# EAGLE design Roboteq_Board_V1.0 (EAGLE 9.2.2)
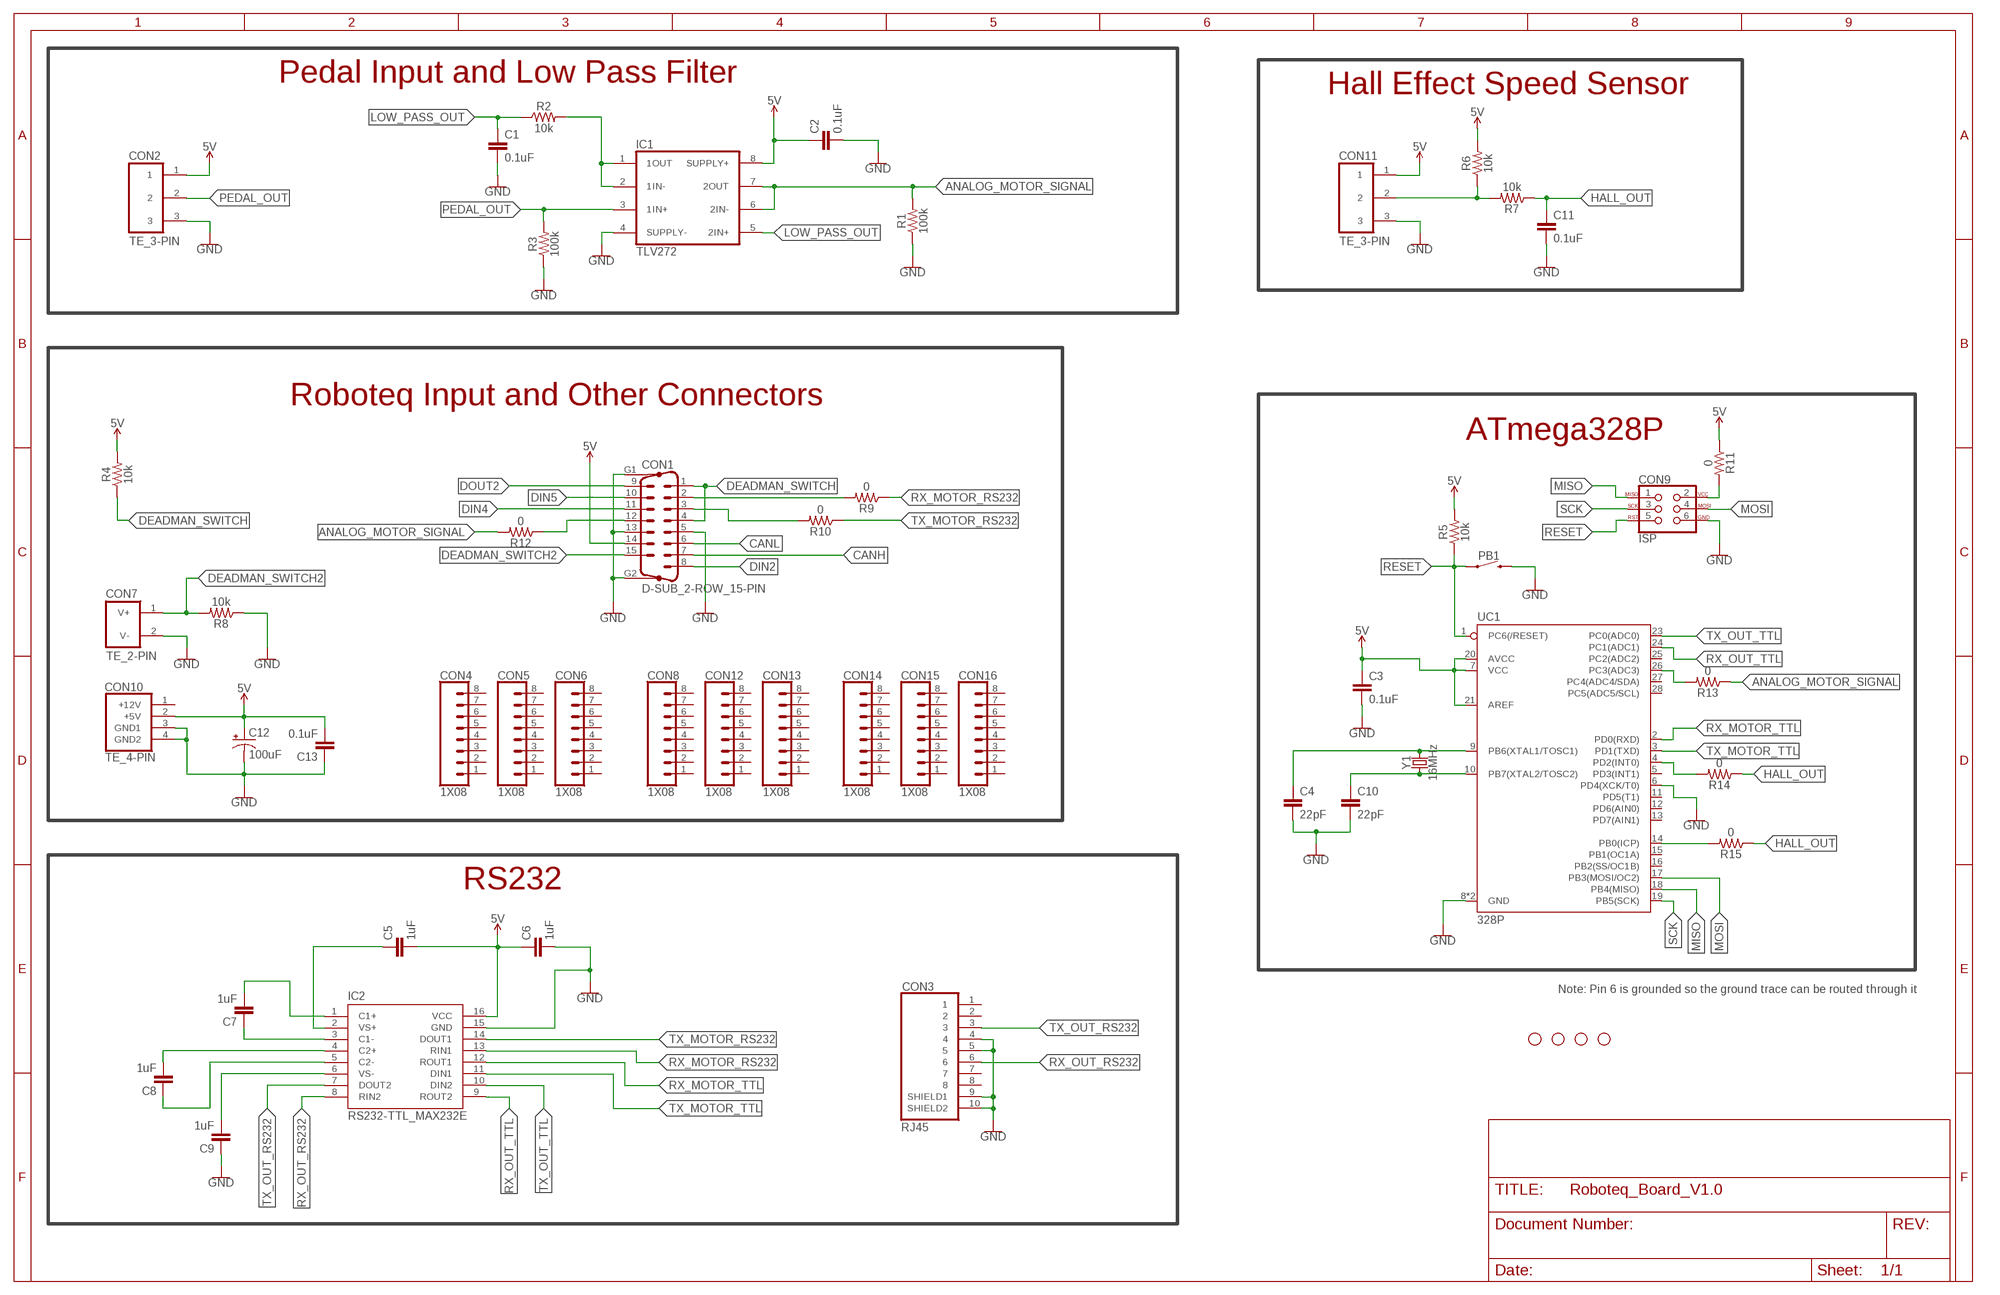
[diagram p0: schematic, sheet 1]

## Parts
C1  0.1uF  CAPACITOR_CERAMIC_THROUGH-HOLE  [CAP-PTH-5MM]
C2  0.1uF  CAPACITOR_CERAMIC_THROUGH-HOLE  [CAP-PTH-5MM]
C3  0.1uF  CAPACITOR_CERAMIC_THROUGH-HOLE  [CAP-PTH-5MM]
C4  22pF  CAPACITOR_CERAMIC_THROUGH-HOLE  [CAP-PTH-5MM]
C5  1uF  CAPACITOR_CERAMIC_THROUGH-HOLE  [CAP-PTH-5MM]
C6  1uF  CAPACITOR_CERAMIC_THROUGH-HOLE  [CAP-PTH-5MM]
C7  1uF  CAPACITOR_CERAMIC_THROUGH-HOLE  [CAP-PTH-5MM]
C8  1uF  CAPACITOR_CERAMIC_THROUGH-HOLE  [CAP-PTH-5MM]
C9  1uF  CAPACITOR_CERAMIC_THROUGH-HOLE  [CAP-PTH-5MM]
C10  22pF  CAPACITOR_CERAMIC_THROUGH-HOLE  [CAP-PTH-5MM]
C11  0.1uF  CAPACITOR_CERAMIC_THROUGH-HOLE  [CAP-PTH-5MM]
C12  100uF  CAPACITOR_ELECTROLYTIC_100UF  [CAPACITOR_100UF_50V]
C13  0.1uF  CAPACITOR_CERAMIC_THROUGH-HOLE  [CAP-PTH-5MM]
CON1  D-SUB_2-ROW_15-PIN  [D-SUB_2-ROW_15-PIN]
CON2  TE_3-PIN  [TE_3-PIN]
CON3  RJ45  [RJ45]
CON4  1X08  [1X08]
CON5  1X08  [1X08]
CON6  1X08  [1X08]
CON7  TE_2-PIN  [TE_2-PIN]
CON8  1X08  [1X08]
CON9  ISP  [ISP_CONNECTOR]
CON10  TE_4-PIN  [TE_4-PIN]
CON11  TE_3-PIN  [TE_3-PIN]
CON12  1X08  [1X08]
CON13  1X08  [1X08]
CON14  1X08  [1X08]
CON15  1X08  [1X08]
CON16  1X08  [1X08]
H1  STAND-OFF  [STAND-OFF]
H2  STAND-OFF  [STAND-OFF]
H3  STAND-OFF  [STAND-OFF]
H4  STAND-OFF  [STAND-OFF]
IC1  TLV272  OP-AMP_DUAL  [DIP08]
IC2  RS232-TTL_MAX232E  [DIP16]
PB1  PUSHBUTTON  [PUSHBUTTON]
R1  100k  RESISTOR_THROUGH-HOLE_1/4W  [AXIAL-0.3]
R2  10k  RESISTOR_THROUGH-HOLE_1/4W  [AXIAL-0.3]
R3  100k  RESISTOR_THROUGH-HOLE_1/4W  [AXIAL-0.3]
R4  10k  RESISTOR_THROUGH-HOLE_1/4W  [AXIAL-0.3]
R5  10k  RESISTOR_THROUGH-HOLE_1/4W  [AXIAL-0.3]
R6  10k  RESISTOR_THROUGH-HOLE_1/4W  [AXIAL-0.3]
R7  10k  RESISTOR_THROUGH-HOLE_1/4W  [AXIAL-0.3]
R8  10k  RESISTOR_THROUGH-HOLE_1/4W  [AXIAL-0.3]
R9  0  RESISTOR_THROUGH-HOLE_1/4W  [AXIAL-0.3]
R10  0  RESISTOR_THROUGH-HOLE_1/4W  [AXIAL-0.3]
R11  0  RESISTOR_THROUGH-HOLE_1/4W  [AXIAL-0.3]
R12  0  RESISTOR_THROUGH-HOLE_1/4W  [AXIAL-0.3]
R13  0  RESISTOR_THROUGH-HOLE_1/4W  [AXIAL-0.3]
R14  0  RESISTOR_THROUGH-HOLE_1/4W  [AXIAL-0.3]
R15  0  RESISTOR_THROUGH-HOLE_1/4W  [AXIAL-0.3]
UC1  328P  ATMEGA328P_DIP28  [DIP28]
Y1  16MHz  CRYSTAL-16MHZPTH-HC49US  [HC49US]

## Nets
5V: C2.1 C3.1 C5.2 C6.1 C12.+ C13.2 CON1.14 CON2.1 CON10.2(+5V) CON11.1 IC1.8(SUPPLY+) IC2.16(VCC) R4.P$2 R5.P$2 R6.P$2 R11.P$1 UC1.7(VCC) UC1.20(AVCC) UC1.21(AREF)
ANALOG_MOTOR_SIGNAL: IC1.6(2IN-) IC1.7(2OUT) R1.P$2 R12.P$2 R13.P$1
CANH: CON1.7
CANL: CON1.6
DEADMAN_SWITCH: CON1.1 CON1.4 R4.P$1
DEADMAN_SWITCH2: CON1.15 CON7.1(V+) R8.P$2
DIN2: CON1.8
DIN4: CON1.11
DIN5: CON1.10
DOUT2: CON1.9
GND: C1.2 C2.2 C3.2 C4.2 C6.2 C9.1 C10.2 C11.2 C12.- C13.1 CON1.5 CON1.13 CON1.G1(GND1) CON1.G2(GND2) CON2.3 CON3.4 CON3.5 CON3.9(SHIELD1) CON3.10(SHIELD2) CON7.2(V-) CON9.6 CON10.3(GND1) CON10.4(GND2) CON11.3 IC1.4(SUPPLY-) IC2.15(GND) PB1.3 PB1.4 R1.P$1 R3.P$1 R8.P$1 UC1.6(PD4(XCK/T0)) UC1.8(GND) UC1.22(GND)
HALL_OUT: C11.1 R7.P$1 R14.P$1 R15.P$1
LOW_PASS_OUT: C1.1 IC1.5(2IN+) R2.P$1
MISO: CON9.1 UC1.18(PB4(MISO))
MOSI: CON9.4 UC1.17(PB3(MOSI/OC2))
N$1: CON1.2 R9.P$2
N$2: IC1.1(1OUT) IC1.2(1IN-) R2.P$2
N$3: R13.P$2 UC1.26(PC3(ADC3))
N$4: C4.1 UC1.9(PB6(XTAL1/TOSC1)) Y1.2
N$5: C10.1 UC1.10(PB7(XTAL2/TOSC2)) Y1.1
N$6: C7.2 IC2.1(C1+)
N$7: C5.1 IC2.2(VS+)
N$8: C7.1 IC2.3(C1-)
N$9: C8.2 IC2.4(C2+)
N$10: C8.1 IC2.5(C2-)
N$11: C9.2 IC2.6(VS-)
N$12: CON11.2 R6.P$1 R7.P$2
N$13: CON1.3 R10.P$2
N$14: CON9.2 R11.P$2
N$15: CON1.12 R12.P$1
N$16: R14.P$2 UC1.4(PD2(INT0))
N$17: R15.P$2 UC1.14(PB0(ICP))
PEDAL_OUT: CON2.2 IC1.3(1IN+) R3.P$2
RESET: CON9.5 PB1.1 PB1.2 R5.P$1 UC1.1(PC6(/RESET))
RX_MOTOR_RS232: IC2.13(RIN1) R9.P$1
RX_MOTOR_TTL: IC2.12(ROUT1) UC1.2(PD0(RXD))
RX_OUT_RS232: CON3.6 IC2.8(RIN2)
RX_OUT_TTL: IC2.9(ROUT2) UC1.24(PC1(ADC1))
SCK: CON9.3 UC1.19(PB5(SCK))
TX_MOTOR_RS232: IC2.14(DOUT1) R10.P$1
TX_MOTOR_TTL: IC2.11(DIN1) UC1.3(PD1(TXD))
TX_OUT_RS232: CON3.3 IC2.7(DOUT2)
TX_OUT_TTL: IC2.10(DIN2) UC1.23(PC0(ADC0))
Unconnected: CON3.1 CON3.2 CON3.7 CON3.8 CON4.1 CON4.2 CON4.3 CON4.4 CON4.5 CON4.6 CON4.7 CON4.8 CON5.1 CON5.2 CON5.3 CON5.4 CON5.5 CON5.6 CON5.7 CON5.8 CON6.1 CON6.2 CON6.3 CON6.4 CON6.5 CON6.6 CON6.7 CON6.8 CON8.1 CON8.2 CON8.3 CON8.4 CON8.5 CON8.6 CON8.7 CON8.8 CON10.1(+12V) CON12.1 CON12.2 CON12.3 CON12.4 CON12.5 CON12.6 CON12.7 CON12.8 CON13.1 CON13.2 CON13.3 CON13.4 CON13.5 CON13.6 CON13.7 CON13.8 CON14.1 CON14.2 CON14.3 CON14.4 CON14.5 CON14.6 CON14.7 CON14.8 CON15.1 CON15.2 CON15.3 CON15.4 CON15.5 CON15.6 CON15.7 CON15.8 CON16.1 CON16.2 CON16.3 CON16.4 CON16.5 CON16.6 CON16.7 CON16.8 UC1.5(PD3(INT1)) UC1.11(PD5(T1)) UC1.12(PD6(AIN0)) UC1.13(PD7(AIN1)) UC1.15(PB1(OC1A)) UC1.16(PB2(SS/OC1B)) UC1.25(PC2(ADC2)) UC1.27(PC4(ADC4/SDA)) UC1.28(PC5(ADC5/SCL))

## Notes on the sheet
- Pedal Input and Low Pass Filter
- Hall Effect Speed Sensor
- Roboteq Input and Other Connectors
- ATmega328P
- RS232
- Note: Pin 6 is grounded so the ground trace can be routed through it

## Library data of the parts
C1-C11 C13 = EcoCar-Passives:CAPACITOR_CERAMIC_THROUGH-HOLE
C12 = EcoCar-Passives:CAPACITOR_ELECTROLYTIC_100UF: 50V 100uF Electrolytic Capacitor Manufacturer: Nichicon Series: UVZ Part Number: UVZ1H101MPD1TD Digikey Part Number: 493-13464-1-ND
CON1 = EcoCar-Connectors:D-SUB_2-ROW_15-PIN: 15 Pin D-SUB for Roboteq Motor Controller Female Connector Part: AE10931-ND
CON2 CON11 = EcoCar-Connectors:TE_3-PIN: 3 Pin TE Mini-Universal MATE-N-LOK Part Number: 1-770967-0 Digikey Part Number: A32473-ND Matching Plug: A25588-ND Matching Crimps: A100828CT-ND
CON3 = EcoCar-Connectors:RJ45: RJ45 Connector - Use for signals and low power connections Unshielded Part Number: RJHSE-5080 Unshielded Digikey Part Number: RJHSE-5080-ND Shielded Part Number: RJHSE5E80 Shielded Digikey Part Number: RJHSE5E80-ND
CON4-CON6 CON8 CON12-CON16 = EcoCar-Connectors-2.54mm:1X08: 2.54mm (0.1") Header
CON7 = EcoCar-Connectors:TE_2-PIN: 2 Pin TE Mini-Universal MATE-N-LOK - Use for signals and power connections Part Number: 1-770966-0 Digikey Part Number: A32471-ND Matching Plug: A25587-ND Matching Crimps: A100828CT-ND
CON9 = EcoCar-Microcontrollers:ISP: ISP Header Use for programming microcontrollers such as the 328P
CON10 = EcoCar-Connectors:TE_4-PIN: 4 Pin TE Mini-Universal MATE-N-LOK - Use for 12V and 5V connections Part Number: 1-770968-0 Digikey Part Number: A32474-ND Matching Plug: A25571-ND Matching Crimps: A100828CT-ND
H1-H4 = EcoCar-Miscellaneous:STAND-OFF: Stand Off Drill holes for mechanically mounting via screws, standoffs, etc. Note: Use the keepout ring to avoid running the screw head into surrounding components. Variant Overviews STAND-OFF - Mechanical footprint for a #4 phillips button head screw. STAND-OFF-TIGHT - Mechanical footprint for a #4 phillips button head screw, Example SparkFun Products Screw - Phillips Head (1/4", 4-40, 10 pack) <https://www.sparkfun.com/products/10453> (PRT-10453) Screw - Phillips Head (1/2", 4-40, 10 pack) <https://www.sparkfun.com/products/10452> (PRT-10452) Screw - Phillips Head (3/4", 4-40, 10 pack) <https://www.sparkfun.com/products/10451> (PRT-10451) Screw - Phillips Head (1", 4-40, 10 pack) <https://www.sparkfun.com/products/10450> (PRT-10450)
IC1 = EcoCar-Integrated-Circuits:OP-AMP_DUAL
IC2 = EcoCar-Integrated-Circuits:RS232-TTL_MAX232E: Dual 5V TTL to RS-232 Converter Manufacturer: Texas Instruments Part Number: MAX232EIN Digikey Part Number: 296-27963-5-ND
PB1 = EcoCar-Electromechanical:PUSHBUTTON: Pushbutton Manufacturer: TE Connectivity ALCOSWITCH Switches Part Number: 1825910-6 Digikey Part Number: 450-1650-ND
R1-R15 = EcoCar-Passives:RESISTOR_THROUGH-HOLE_1/4W
UC1 = EcoCar-Microcontrollers:ATMEGA328P_DIP28: ATmega328P Manufacturer: Microchip Part Number: ATMEGA328P-PU Digikey Part Number: ATMEGA328P-PU-ND; PROD_ID: IC-09136
Y1 = EcoCar-Microcontrollers:CRYSTAL-16MHZ: 16MHz Crystal Oscillator Manufacturer: TXC Part Number: 9B-16.000MBBK-B Digikey Part Number: 887-2015-ND; PROD_ID: XTAL-08181; SF_ID: COM-00536

## Board
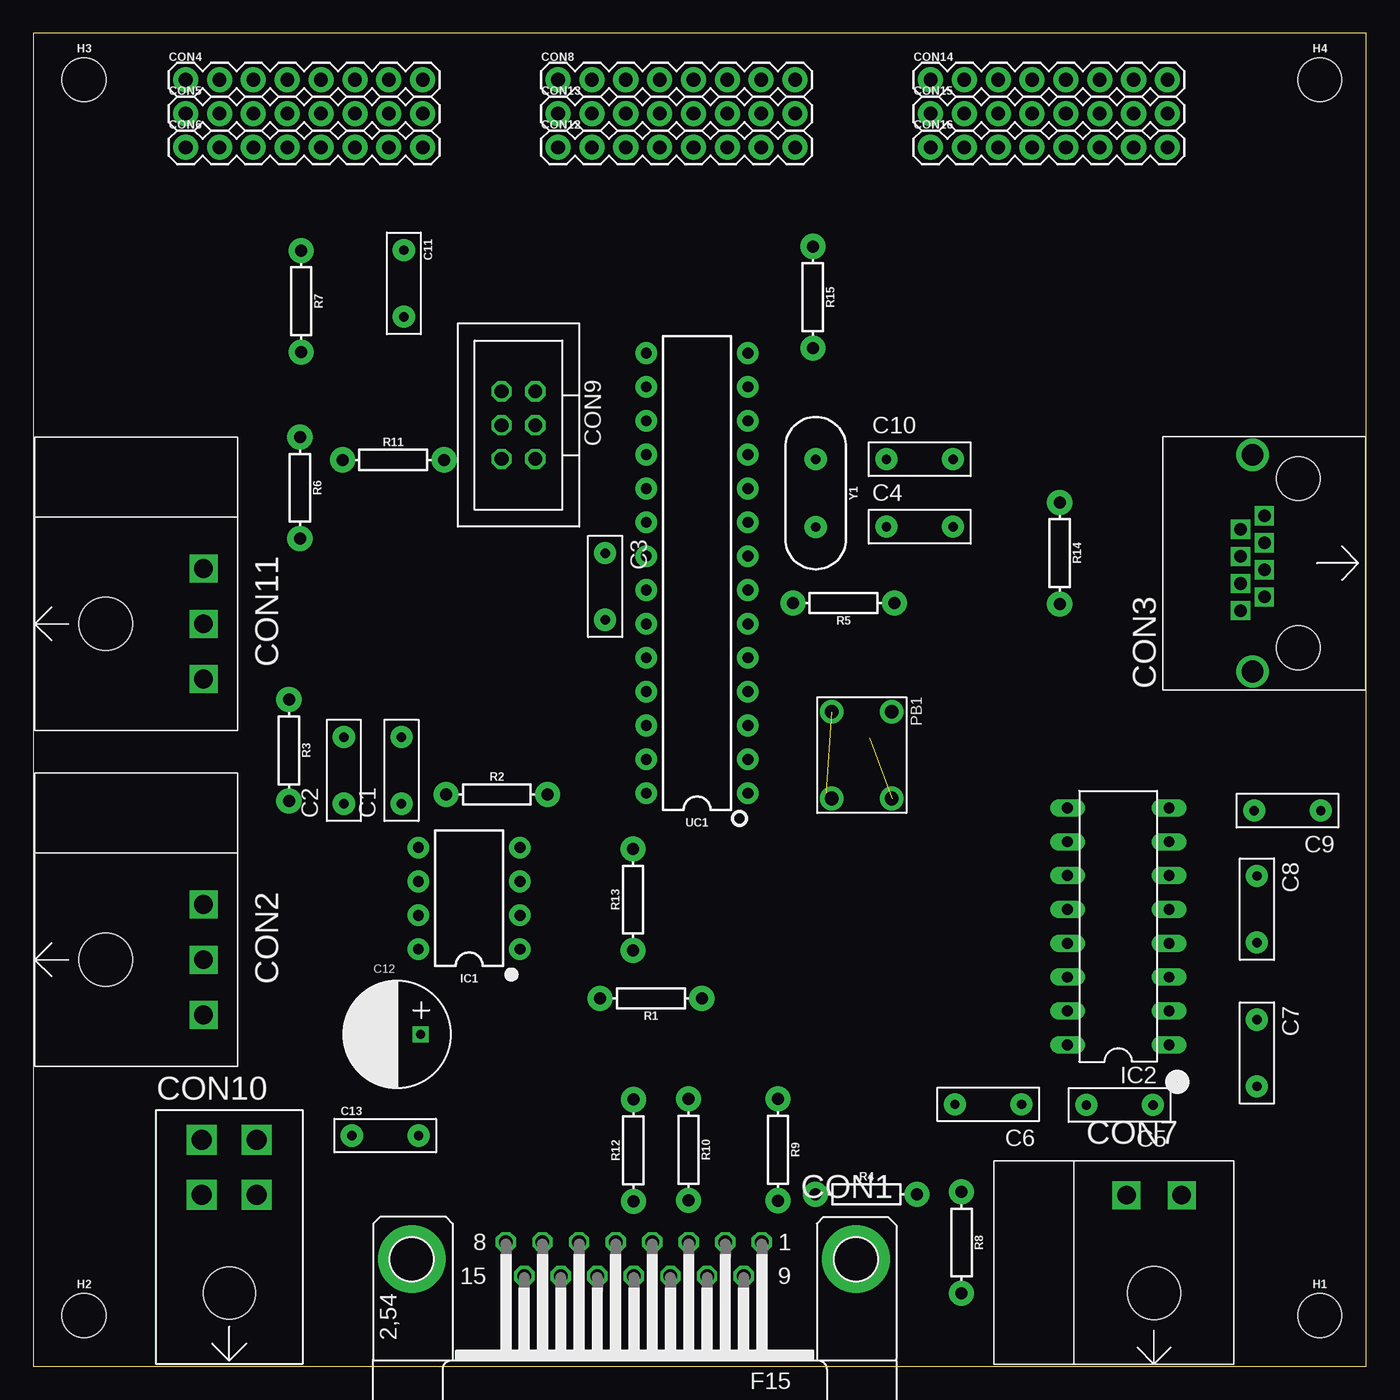
[diagram p1: board, top side]
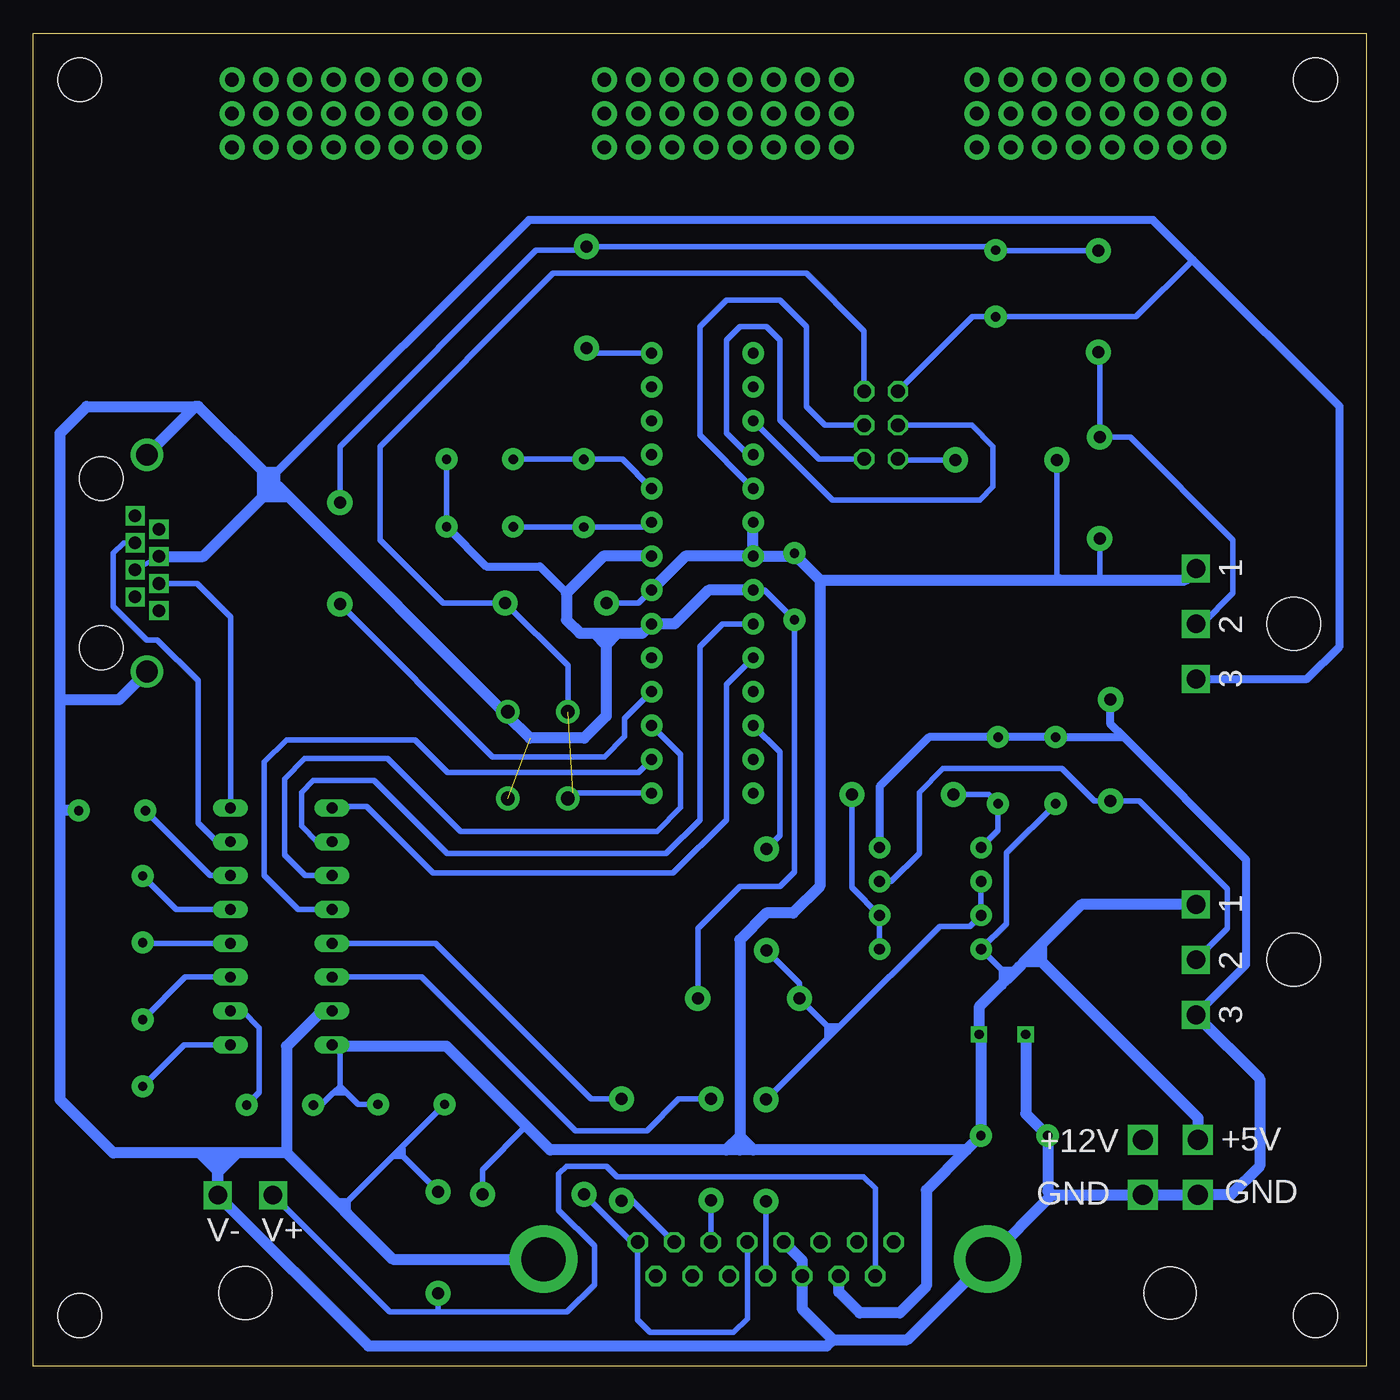
[diagram p2: board, bottom side, seen from below]

Size 100 x 100 mm. Coordinates in mm from the lower left corner, seen from the top.
Outline: 0,0 100,0 100,100 0,100 0,0
Copper layers (1*16): Top 0.035mm / dielectric 1.5mm / Bottom 0.035mm
Design rules "SeeedStudio_2layer_DRU_no_angle_20140221": minimum track width 6mil, minimum drill 12mil, track to track 6mil, track to pad 6mil, pad to pad 6mil, via to via 6mil, smd to smd 0mil, copper to edge 10mil, drill to drill 10mil, minimum pad ring 10mil, minimum via ring 6mil, stop-mask expansion 2mil, vias tented up to drill 100mil, thermal gap 10mil

### Footprints (pad centres in the part's own frame; a part is rotated, then mirrored left to right if it is on the bottom)
CAP-PTH-5MM = drill 0.7 pad 1.651: 1 -2.5,0; 2 2.5,0
CAPACITOR_100UF_50V = drill 0.7 square: + 1.75,0; - -1.75,0
D-SUB_2-ROW_15-PIN = drill 1.016 octagon: 1 -9.601,-1.27; 2 -6.858,-1.27; 3 -4.115,-1.27; 4 -1.372,-1.27; 5 1.372,-1.27; 6 4.115,-1.27; 7 6.858,-1.27; 8 9.601,-1.27; 9 -8.23,1.27; 10 -5.486,1.27; 11 -2.743,1.27; 12 0,1.27; 13 2.743,1.27; 14 5.486,1.27; 15 8.23,1.27 | drill 3.302 pad 5.08: G1 -16.662,0; G2 16.662,0
TE_3-PIN = drill 1.4 square: 1 -4.14,12.67; 2 0,12.67; 3 4.14,12.67 | hole 4: 0,5.33
RJ45 = drill 0.94 square: 1 9.9,2.54; 2 8.88,4.32; 3 7.87,2.54; 4 6.85,4.32; 5 5.84,2.54; 6 4.82,4.32; 7 3.81,2.54; 8 2.79,4.32 | drill 1.62: 9 -1.78,3.43; 10 14.48,3.43 | hole 3.3: 0,0; 12.7,0
1X08 = drill 1.016 pad 1.88: 1 0,0; 2 2.54,0; 3 5.08,0; 4 7.62,0; 5 10.16,0; 6 12.7,0; 7 15.24,0; 8 17.78,0
TE_2-PIN = drill 1.4 square: 1 -2.07,12.67; 2 2.07,12.67 | hole 4: 0,5.33
ISP_CONNECTOR = drill 1.016 octagon: 1 2.54,1.27; 2 2.54,-1.27; 3 0,1.27; 4 0,-1.27; 5 -2.54,1.27; 6 -2.54,-1.27
TE_4-PIN = drill 1.5 square: 1 2.07,11.48; 2 -2.07,11.48; 3 2.07,7.34; 4 -2.07,7.34 | hole 3.91: 0,0
STAND-OFF = hole 3.302: 0,0
DIP08 = drill 0.813 pad 1.626: 1 -3.81,-3.81; 2 -1.27,-3.81; 3 1.27,-3.81; 4 3.81,-3.81; 5 3.81,3.81; 6 1.27,3.81; 7 -1.27,3.81; 8 -3.81,3.81
DIP16 = drill 0.813 long: 1 -8.89,-3.81; 2 -6.35,-3.81; 3 -3.81,-3.81; 4 -1.27,-3.81; 5 1.27,-3.81; 6 3.81,-3.81; 7 6.35,-3.81; 8 8.89,-3.81; 9 8.89,3.81; 10 6.35,3.81; 11 3.81,3.81; 12 1.27,3.81; 13 -1.27,3.81; 14 -3.81,3.81; 15 -6.35,3.81; 16 -8.89,3.81
PUSHBUTTON = drill 1.04 pad 1.778: 1 0,0; 2 6.5,0; 3 0,4.5; 4 6.5,4.5
AXIAL-0.3 = drill 0.9 pad 1.88: P$1 -3.81,0; P$2 3.81,0
DIP28 = drill 0.813 pad 1.626: 1 -16.51,-3.81; 2 -13.97,-3.81; 3 -11.43,-3.81; 4 -8.89,-3.81; 5 -6.35,-3.81; 6 -3.81,-3.81; 7 -1.27,-3.81; 8 1.27,-3.81; 9 3.81,-3.81; 10 6.35,-3.81; 11 8.89,-3.81; 12 11.43,-3.81; 13 13.97,-3.81; 14 16.51,-3.81; 15 16.51,3.81; 16 13.97,3.81; 17 11.43,3.81; 18 8.89,3.81; 19 6.35,3.81; 20 3.81,3.81; 21 1.27,3.81; 22 -1.27,3.81; 23 -3.81,3.81; 24 -6.35,3.81; 25 -8.89,3.81; 26 -11.43,3.81; 27 -13.97,3.81; 28 -16.51,3.81
HC49US = drill 0.7 pad 1.651: 1 -2.54,0; 2 2.54,0

### Placement (x,y rotation side)
C1  27.62,44.7 90 top
C2  23.3,44.7 90 top
C3  42.9,58.5 270 top
C4  66.5,62.98 0 top
C5  81.5,19.6 180 top
C6  71.64,19.65 180 top
C7  91.8,23.5 270 top
C8  91.8,34.29 270 top
C9  94.09,41.68 180 top
C10  66.5,68.05 0 top
C11  27.8,81.23 270 top
C12  27.3,24.9 0 top
C13  26.4,17.3 0 top
CON1  45.06,8.03 180 top
CON2  0.1,30.5 270 top
CON3  94.9,53.9 90 top
CON4  11.43,96.52 0 top
CON5  11.43,93.98 0 top
CON6  11.43,91.44 0 top
CON7  84.08,0.16 0 top
CON8  39.37,96.52 0 top
CON9  36.4,70.6 270 top
CON10  14.7,5.5 0 top
CON11  0.1,55.7 270 top
CON12  39.37,91.44 0 top
CON13  39.37,93.98 0 top
CON14  67.31,96.52 0 top
CON15  67.31,93.98 0 top
CON16  67.31,91.44 0 top
H1  96.52,3.81 0 top
H2  3.81,3.81 0 top
H3  3.81,96.52 0 top
H4  96.52,96.52 0 top
IC1  32.7,35.1 90 top
IC2  81.4,33 90 top
PB1  59.9,49.1 270 top
R1  46.34,27.59 180 top
R2  34.77,42.9 0 top
R3  19.18,46.2 270 top
R4  62.5,12.9 0 top
R5  60.79,57.25 180 top
R6  20,65.9 270 top
R7  20.1,79.9 270 top
R8  69.64,9.27 270 top
R9  55.87,16.23 270 top
R10  49.16,16.24 270 top
R11  27,68 0 top
R12  45.02,16.19 90 top
R13  45,35 90 top
R14  77,61 270 top
R15  58.48,80.2 270 top
UC1  49.8,59.5 90 top
Y1  58.7,65.5 270 top

### Tracks (layer width: path | path; a pad name or v marks a point on that pad's centre or on a via)
5V
  Bottom 0.254: 44.45,60.77 44.22,61 C3.1
  Bottom 0.406: IC2.16 77,23.52 77,21 | 77,21 76.49,20.49 | 76.49,20.49 75.65,19.65 C6.1 | 77,21 77.51,20.49 | 77.51,20.49 78.4,19.6 C5.2 | 77.51,20.49 77,20.49 | 77,20.49 76.49,20.49 | 77,20.49 77,21 | 63.01,18.01 66.31,14.72 R4.P$2 | 29.05,25.45 C12.+ | 27.38,29.77 IC1.8 27,33.18 27,38.5 C2.1 | 27.36,29.77 27,29.4 27,29 | 26.03,29.97 26.23,29.77 27.38,29.77 | 27.38,29.77 27.36,29.77 | 27.36,29.77 27.36,28.64 | R5.P$2 54.59,57.25 UC1.7 | R11.P$1 23.19,59.19 23,59 | R6.P$2 20,59
  Bottom 0.813: CON1.14 39.57,5.57 38,4 35,4 33,6 33,13.2 29.98,16.22 | CON2.1 21.36,34.64 24.32,31.68 | 24.32,31.68 25,31 | 25,31 25.68,30.32 | 25.68,30.32 26.03,29.97 27,29 27.36,28.64 29.05,26.95 C12.+ 28.9,24.75 C13.2 29.98,16.22 | 25,31 24.32,30.32 | 24.32,30.32 12.63,18.63 CON10.2 | 24.32,30.32 24.32,31.68 | 24.32,30.32 25.68,30.32 | 29.98,16.22 45.97,16.22 | 45.97,16.22 47,16.22 | 47,16.22 48.03,16.22 | 48.03,16.22 61.22,16.22 63.01,18.01 69,24 77.48,24 IC2.16 | UC1.21 51.07,60.77 UC1.7 | UC1.21 UC1.20 | UC1.21 44.45,60.77 42.77,60.77 41,59 | 47,17.24 47,16.22 | 45.97,16.22 47,17.24 | 47,17.24 48.03,16.22 | 41,59 41,36 43,34 45,34 47,32 47,17.24 | 41,59 23,59 20,59 13.61,59 CON11.1
ANALOG_MOTOR_SIGNAL
  Bottom 0.406: IC1.6 IC1.7 29.72,33 32,33 39.48,25.52 | 39.48,25.52 40,25 | 40,25 40.37,24.63 | 40.37,24.63 45,20 R12.P$2 | R13.P$1 42.53,28.72 R1.P$2 40.45,25.52 | 40.45,25.52 40,25.07 40,25 | 39.48,25.52 40.45,25.52 | 40.45,25.52 40.45,24.7 40.37,24.63
DEADMAN_SWITCH
  Bottom 0.406: CON1.4 46.43,3.57 47.46,2.54 53.72,2.54 54.66,3.48 CON1.1 55.09,9.3 R4.P$1
DEADMAN_SWITCH2
  Bottom 0.406: CON1.15 36.83,13.34 37.72,14.22 56.22,14.22 57,15 60,15 60.58,14.42 60.58,11.68 57.91,9.02 57.91,6.1 59.94,4.06 69.6,4.06 | CON7.1 73.25,4.06 69.6,4.06 | R8.P$2 69.64,4.11 69.6,4.06
GND  (1 unrouted)
  Bottom 0.406: CON3.4 CON3.5 | C10.2 C4.2 | C6.2 72.4,16.39 | 72.4,16.39 72.65,16.14 | 72.65,16.14 73.03,15.76 | 73.03,15.76 76.39,12.39 | 76.39,12.39 76.79,12 77,12 | 76.39,12.39 77.39,12.39 77.52,12.52 | 76.39,12.39 76.39,11.49 76.44,11.44 | UC1.22 45.13,58.23 C3.2 42.9,37.1 44,36 47,36 50.15,32.85 R1.P$1 | 13,83 17.27,78.73 C11.2 29.54,78.73 CON9.6 | R8.P$1 69.64,13.13 72.26,15.75 | 72.26,15.75 72.65,16.14 | 72.26,15.75 72.26,16.26 72.4,16.39 | 72.26,15.75 73.03,15.75 73.03,15.76
  Bottom 0.61: CON2.3 9,30.13 9,38 18.2,47.2 | R3.P$1 19.18,48.18 18.2,47.2 | IC1.4 36.51,43.49 32.8,47.2 C1.2 C2.2 18.2,47.2 | C4.2 66.02,60 62,60 60,58 | 56.01,55 56.01,54.99 57.02,53.98 58.05,55 58.29,55 | CON11.3 4.44,51.56 2,54 2,72 13,83 16,86 62.81,86 81.71,67.1 | 81.71,67.1 82.81,66 | 82.8,67.18 81.79,67.18 | 81.79,67.18 81.71,67.1 | 81.79,67.18 81.79,66.17 81.53,65.91
  Bottom 0.813: CON1.5 42.32,7.93 CON1.13 42.32,4.32 40,2 | 40,2 34.43,2 CON1.G2 23.59,12.84 | 23.59,12.84 CON10.3 CON10.4 10.16,12.84 8,15 8,21.59 CON2.3 | C12.- 25.55,18.95 C13.1 23.9,13.15 23.59,12.84 | IC2.15 78.35,26.65 81,24 81,16 | 81,16 77.52,12.52 77,12 76.44,11.44 73.03,8.03 CON1.G1 | 81,16 84.71,16 | CON7.2 86.16,14.56 85.86,14.86 | 84.71,16 85.86,14.86 | CON7.2 74.85,1.52 40.48,1.52 40,2 | UC1.22 49.34,58.23 51.88,55.69 UC1.6 54.3,55 56.01,55 57.02,55 | UC1.8 57.23,60.77 60,58 60,56 59,55 58.29,55 57.02,55 | 64.4,48.78 62.74,47.12 58.67,47.12 57.02,48.77 57.02,53.98 57.02,55 | 64.4,48.78 PB1.3 | 98,41.78 98,20 94,16 87.5,16 | 98,41.78 98,50 | 98,50 98,70 96,72 87.85,72 | 84.71,16 86.23,16 | 86.23,16 86.74,16 | 86.74,16 87.5,16 | CON7.2 86.16,14.65 87.5,16 | 85.86,14.86 85.86,15.62 86.23,16 | 85.86,14.86 86.74,15.74 86.74,16 | 82.8,67.18 87.62,72 87.85,72 | 82.8,67.18 81.81,66.19 | 81.81,66.19 81.53,65.91 80.81,65.19 | 80.81,65.19 64.4,48.78 | CON3.4 87.25,60.75 82.81,65.19 | 82.81,65.19 81.81,66.19 | 80.81,65.19 82.81,65.19 | 82.81,65.19 82.81,66 82.81,67.18 82.8,67.18 | CON3.10 87.85,72 | CON3.9 93.59,50 98,50 | C9.1 97.9,41.68 98,41.78
HALL_OUT
  Bottom 0.406: R7.P$1 27.77,83.71 C11.1 28.08,84.01 R15.P$1 58.76,83.73 62.27,83.73 77,69 R14.P$1
LOW_PASS_OUT
  Bottom 0.406: IC1.5 27.62,40.18 C1.1 28.32,42.9 R2.P$1
MISO
  Bottom 0.406: CON9.1 41.06,68.06 44,71 44,77 45,78 47,78 48,77 48,70 46.39,68.39 UC1.18
MOSI
  Bottom 0.406: UC1.17 40.06,65 29,65 28,66 28,69 29.6,70.6 CON9.4
N$1
  Bottom 0.406: R9.P$2 55.04,12.42 CON1.2
N$2
  Bottom 0.406: IC1.1 IC1.2 38.58,35.9 R2.P$2
N$3
  Bottom 0.406: UC1.26 44,46.08 44,39.81 R13.P$2
N$4
  Bottom 0.406: UC1.9 53.96,62.96 Y1.2 63.98,62.96 C4.1
N$5
  Bottom 0.406: UC1.10 55.8,68.04 Y1.1 C10.1
N$6
  Bottom 0.406: IC2.1 88.69,24.11 C7.2
N$7
  Bottom 0.406: IC2.2 84.31,26.65 83.06,25.4 83.06,20.54 C5.1
N$8
  Bottom 0.406: IC2.3 88.61,29.19 C7.1
N$9
  Bottom 0.406: C8.2 91.74,31.73 IC2.4
N$10
  Bottom 0.406: C8.1 89.28,34.27 IC2.5
N$11
  Bottom 0.406: C9.2 86.72,36.81 IC2.6
N$12
  Bottom 0.406: CON11.2 12.3,55.7 10,58 10,62 17.71,69.71 R6.P$1 20,75.99 R7.P$2
N$13
  Bottom 0.406: R10.P$2 49.17,12.41 CON1.3
N$14
  Bottom 0.406: CON9.2 35.07,68 R11.P$2
N$15
  Bottom 0.406: CON1.12 45.02,6.8 R12.P$1
N$16
  Bottom 0.406: UC1.4 55.63,48.59 55.63,47.24 57.15,45.72 65.53,45.72 R14.P$2
N$17
  Bottom 0.406: R15.P$2 58.1,76.01 UC1.14
PEDAL_OUT
  Bottom 0.406: CON2.2 10.41,32.86 10.41,35.81 17.02,42.42 19.15,42.42 R3.P$2 20.39,42.39 22.83,44.83 31.75,44.83 33.53,43.05 33.53,38.48 35.64,36.37 IC1.3
RESET  (1 unrouted)
  Bottom 0.406: UC1.1 59.51,42.99 PB1.2 | CON9.5 37.67,77.67 42,82 61,82 74,69 74,62 69.25,57.25 R5.P$1 59.9,52.55 PB1.1
RX_MOTOR_RS232
  Bottom 0.406: R9.P$1 58.14,20.04 69.83,31.73 IC2.13
RX_MOTOR_TTL
  Bottom 0.406: IC2.12 80.12,34.27 82.68,36.83 82.68,45.32 81,47 80.99,46.99 71.37,46.99 68.91,44.53 54.61,44.53 UC1.2
RX_OUT_RS232
  Bottom 0.406: CON3.6 87.72,58.72 85.21,56.21 IC2.8
RX_OUT_TTL
  Bottom 0.406: UC1.24 48,51.14 48,41 52,37 70,37 75,42 77.48,42 IC2.9
SCK
  Bottom 0.406: UC1.19 50,69.86 50,78 48,80 44,80 42,78 42,72 40.6,70.6 CON9.3
TX_MOTOR_RS232
  Bottom 0.406: IC2.14 77.57,29.21 70.87,29.21 59.31,17.65 53.98,17.65 51.58,20.05 R10.P$1
TX_MOTOR_TTL
  Bottom 0.406: UC1.3 51.44,45.9 51.44,41.91 53.21,40.13 67.94,40.13 73.41,45.59 79.63,45.59 81.15,44.07 81.15,38.35 79.61,36.81 IC2.11
TX_OUT_RS232
  Bottom 0.406: IC2.7 86.21,39.35 87.63,40.77 87.63,51.44 90.69,54.5 91.5,54.5 94,57 94,61 93.23,61.77 CON3.3
TX_OUT_TTL
  Bottom 0.406: UC1.23 48.31,55.69 50,54 50,41 52.52,38.48 68.96,38.48 74.42,43.94 78.99,43.94 79.88,43.05 79.88,40.51 78.72,39.35 IC2.10